# Altium schematic sheet outputs.SchDoc: Fault-Tolerant Quadcopter
size A; DrawnBy: Vaughn Kottler; Engineer: Vaughn Kottler; Revision: A
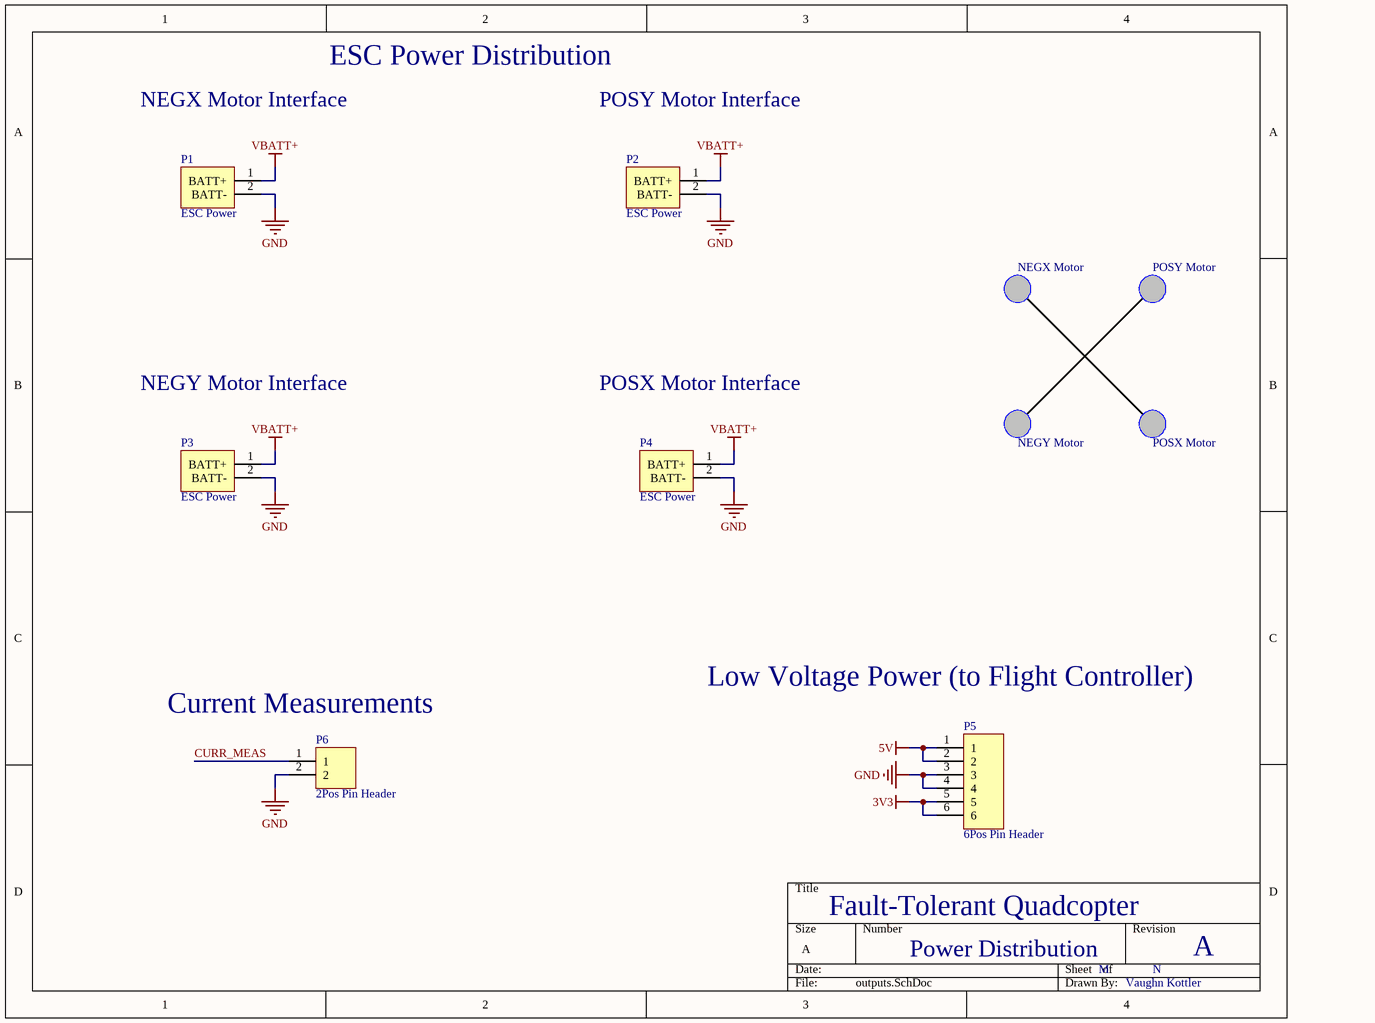
[diagram p0: outputs.SchDoc]

## Parts
P1  ESC Power  [2Pos Screw Terminal]
P2  ESC Power  [2Pos Screw Terminal]
P3  ESC Power  [2Pos Screw Terminal]
P4  ESC Power  [2Pos Screw Terminal]
P5  6Pos Pin Header  [6Pos Pin Header JST]
P6  2Pos Pin Header  [2Pos Pin Header JST]

## Nets
3V3: P5.5 P5.6
5V: P5.1 P5.2
GND: P1.2(BATT-) P2.2(BATT-) P3.2(BATT-) P4.2(BATT-) P5.3 P5.4 P6.2
VBATT+: P1.1(BATT+) P2.1(BATT+) P3.1(BATT+) P4.1(BATT+)
CURR_MEAS: P6.1

## Notes on the sheet
- ESC Power Distribution
- NEGX Motor Interface
- POSY Motor Interface
- NEGX Motor
- POSY Motor
- NEGY Motor Interface
- POSX Motor Interface
- NEGY Motor
- POSX Motor
- Low Voltage Power (to Flight Controller)
- (near P6) Current Measurements
- Power Distribution
- M
- N

## Library data of the parts
P1-P4 = ESC Power: 0.2" Pitch 1x2
P5 = 6Pos Pin Header: 0.1" Pitch 1x6
P6 = 2Pos Pin Header: 0.1" Pitch 1x2